# Altium schematic sheet Tray2_Comms_DTMF.SchDoc: BLUEsat DTMF receiver
size A3; DrawnBy: Thomas Fisk; Engineer: T. FISK; Organization: BLUEsat Project; Address1: Room 419; Address2: School of EE&T; Address3: UNSW, NSW 2052; Address4: Australia; DocumentNumber: COMS0003; SheetNumber: 1; SheetTotal: 1; Description: DTMF decoder for telecommand interface; Version: 1.0
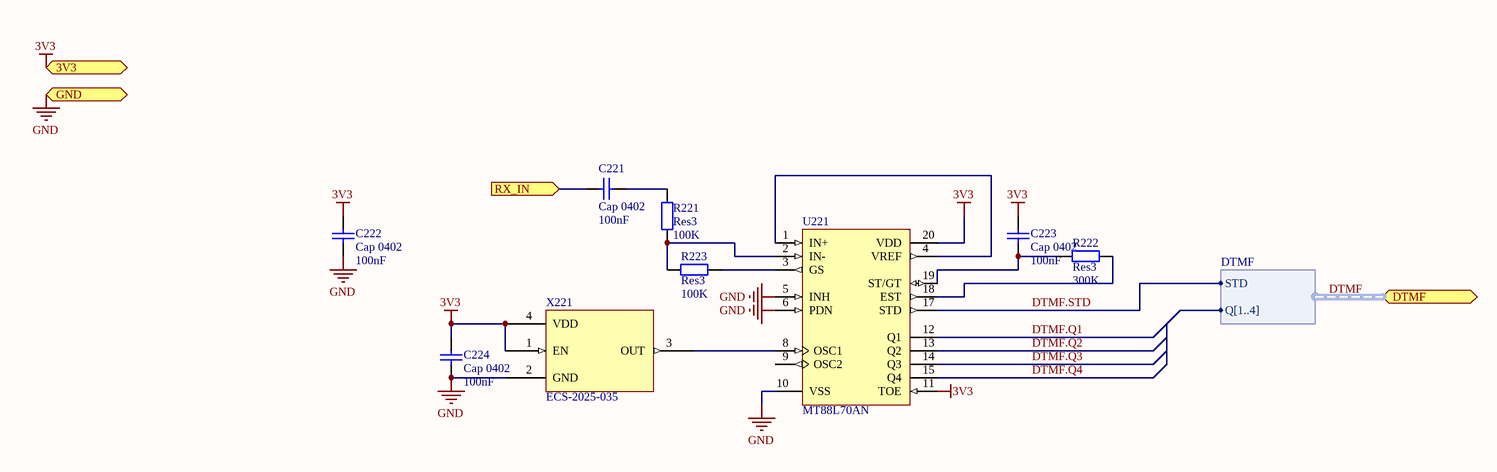
[diagram p0: Tray2_Comms_DTMF.SchDoc]

## Parts
C221  Cap 0402  value 100nF  [CAPC1005X06L]
C222  Cap 0402  value 100nF  [CAPC1005X06L]
C223  Cap 0402  value 100nF  [CAPC1005X06L]
C224  Cap 0402  value 100nF  [CAPC1005X06L]
R221  Res3  value 100K  [RESC1005X06L]
R222  Res3  value 300K  [RESC1005X06L]
R223  Res3  value 100K  [RESC1005X06L]
U221  MT88L70AN  [TSSOP20]
X221  ECS-2025-035  [ECS-2025]

## Ports
3V3 (in), DTMF (harness DTMF), GND (in), RX_IN (in)

## Harnesses
DTMF: STD, Q[1..4]

## Nets
3V3: C222.2 C223.1 C224.1 U221.11(TOE) U221.20(VDD) X221.1(EN) X221.4(VDD) ; port 3V3
GND: C222.1 C224.2 U221.5(INH) U221.6(PDN) U221.10(VSS) X221.2(GND) ; port GND
DTMF.Q1: U221.12(Q1)
DTMF.Q2: U221.13(Q2)
DTMF.Q3: U221.14(Q3)
DTMF.Q4: U221.15(Q4)
DTMF.STD: U221.17(STD) ; port DTMF.STD
RX_IN: C221.2 ; port RX_IN
NetC221_1: C221.1 R221.1
NetC223_2: C223.2 R222.1 U221.19(ST/GT)
NetR221_2: R221.2 R223.1 U221.2(IN-)
NetR222_2: R222.2 U221.18(EST)
NetR223_2: R223.2 U221.3(GS)
NetU221_1: U221.1(IN+) U221.4(VREF)
NetU221_8: U221.8(OSC1) X221.3(OUT)

Not connected (* = marked no-connect by the designer): U221 9(OSC2)

## Buses and harness runs
harness DTMF = port DTMF

## Notes on the sheet
- Title
- Description:
- Size:
- Author:
- Date:
- A3
- Time:
- Version
- Sheet:
- Drawing No.:
- of
- File:

## Library data of the parts
C221-C224 = Cap 0402: Capacitor; Published: 8-Jun-2000; LatestRevisionDate: 17-Jul-2002; LatestRevisionNote: Re-released for DXP Platform.; PackageReference: RAD-0.3; Publisher: Altium Limited; PackageDescription: Radial Cap, Thru-Hole; 2 Leads; 0.3 in Pin Spacing
R221-R223 = Res3: Resistor; Published: 8-Jun-2000; LatestRevisionDate: 29-May-2009; LatestRevisionNote: IPC-7351 Footprint Added.; PackageReference: J1-0603; Publisher: Altium Limited; PackageDescription: Chip Resistor
U221 = MT88L70AN: 3 Volt Integrated DTMF Receiver; Published: 8-Jun-2000; LatestRevisionDate: 13-Apr-2006; LatestRevisionNote: IPC-7351 Footprint Added.; DatasheetVersion: Issue 4 March 1997; PackageVersion: 1997; PackageReference: SOIC18; Publisher: Altium Limited; PackageDescription: 18-Pin Small Outline Integrated Circuit 1.27 mm Pitch; Code_JEDEC: MS-013-AB; ComponentLink1Description: Manufacturer Link; ComponentLink1URL: http://products.zarlink.com; ComponentLink2Description: Datasheet; ComponentLink2URL: http://assets.zarlink.com/DS/zarlink_MT88L70_MAY_05.pdf; Supplier 1: Allied; Supplier Part Number 1: 090-SPEC
X221 = ECS-2025-035: SMD Clock Oscillator, 3.579545MHz